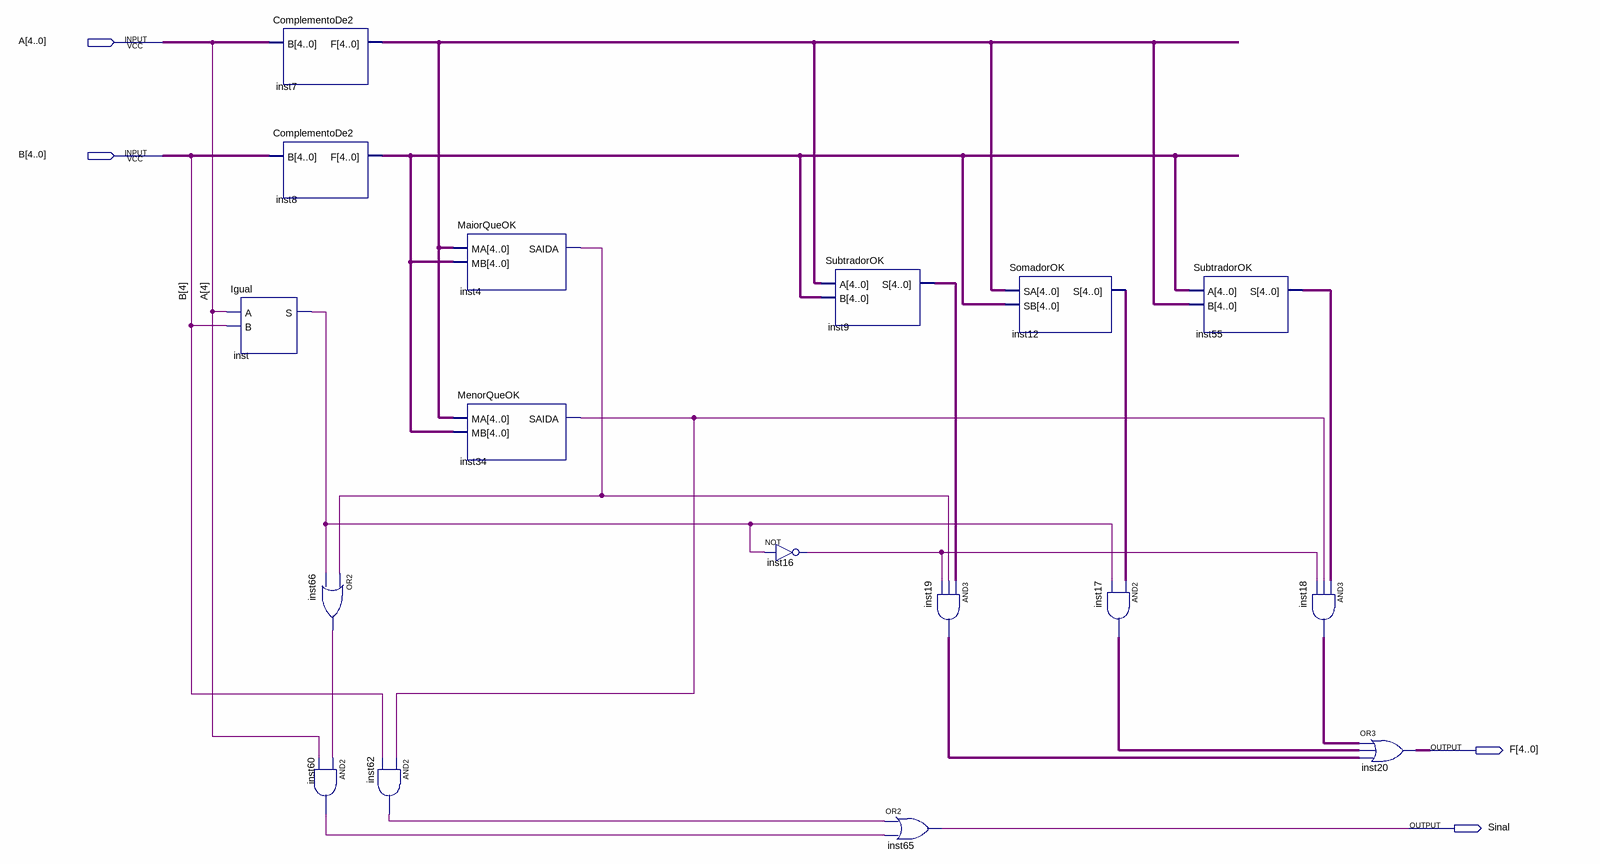
[diagram p0: schematic sheet]
// Quartus schematic SomadorSubtratorOK2.bdf as structural Verilog: 17 symbols, 4 pins
module SomadorSubtratorOK2 (
  input  [4:0] A,
  input  [4:0] B,
  output [4:0] F,
  output Sinal
);

  wire inst4_saida, inst16_out, inst34_saida, inst60_out, inst62_out, inst66_out, inst_s;
  wire [4:0] inst7_f, inst8_f, inst9_s, inst12_s, inst17_out, inst18_out, inst19_out, inst55_s;

  Igual inst (.A(A[4]), .B(B[4]), .S(inst_s));
  ComplementoDe2 inst7 (.B(A), .F(inst7_f));
  ComplementoDe2 inst8 (.B(B), .F(inst8_f));
  or inst66 (inst66_out, inst4_saida, inst_s);
  and inst60 (inst60_out, inst66_out, A[4]);
  and inst62 (inst62_out, inst34_saida, B[4]);
  MaiorQueOK inst4 (.MA(inst7_f), .MB(inst8_f), .SAIDA(inst4_saida));
  MenorQueOK inst34 (.MA(inst7_f), .MB(inst8_f), .SAIDA(inst34_saida));
  not inst16 (inst16_out, inst_s);
  SubtradorOK inst9 (.A(inst7_f), .B(inst8_f), .S(inst9_s));
  or inst65 (Sinal, inst62_out, inst60_out);
  assign inst19_out = inst9_s & {5{inst4_saida}} & {5{inst16_out}};  // AND3 inst19, 5 bits wide
  SomadorOK inst12 (.SA(inst7_f), .SB(inst8_f), .S(inst12_s));
  assign inst17_out = inst12_s & {5{inst_s}};  // AND2 inst17, 5 bits wide
  SubtradorOK inst55 (.A(inst8_f), .B(inst7_f), .S(inst55_s));
  assign inst18_out = inst55_s & {5{inst34_saida}} & {5{inst16_out}};  // AND3 inst18, 5 bits wide
  assign F = inst18_out | inst17_out | inst19_out;  // OR3 inst20, 5 bits wide
endmodule
